# EAGLE schematic vco-arduino-dac (EAGLE 9.6.1)
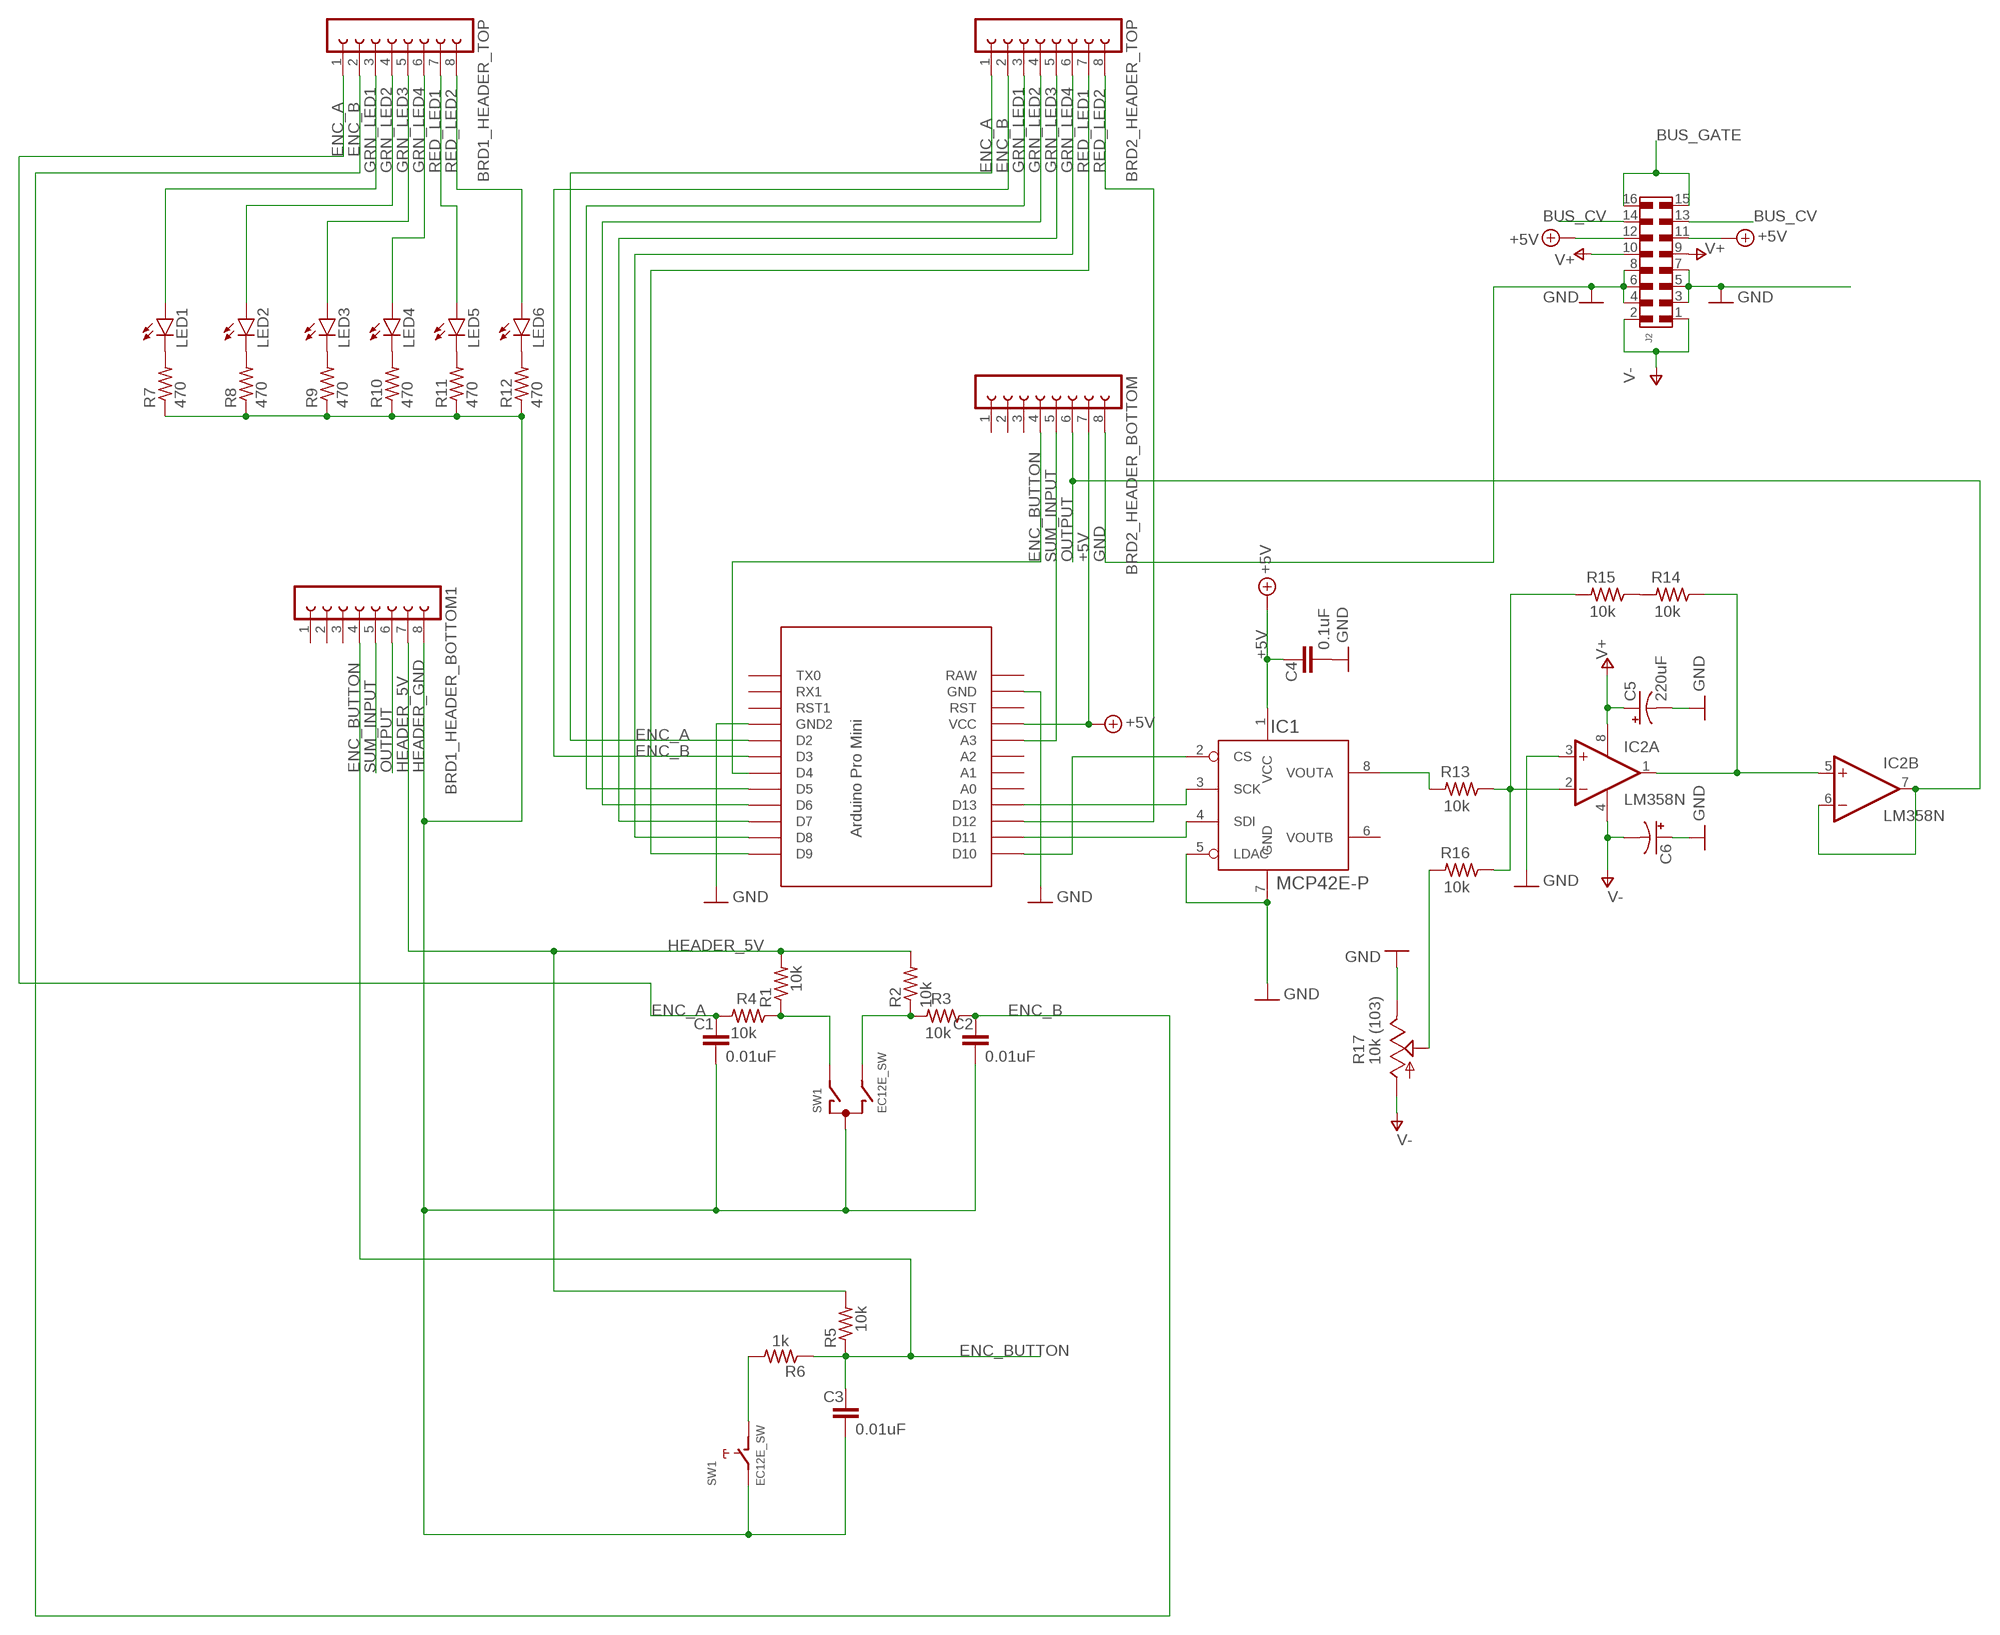
[diagram p0: schematic, sheet 1]

## Parts
BRD1_HEADER_BOTTOM1  FE08-1  [FE08]
BRD1_HEADER_TOP  FE08-1  [FE08]
BRD2_HEADER_BOTTOM  FE08-1  [FE08]
BRD2_HEADER_TOP  FE08-1  [FE08]
C1  0.01uF  C-EU025-024X044  [C025-024X044]
C2  0.01uF  C-EU025-024X044  [C025-024X044]
C3  0.01uF  C-EU025-024X044  [C025-024X044]
C4  0.1uF  C-EU025-024X044  [C025-024X044]
C5  220uF  CPOL-USE2,5-6E  [E2,5-6E]
C6  CPOL-USE2,5-6E  [E2,5-6E]
IC1  MCP42E-P  [DIL08]
IC2  LM358N  [DIL08]
J2  6120XX20621_61201620621  [61201620621]
LED1  LED3MM  [LED3MM]
LED2  LED3MM  [LED3MM]
LED3  LED3MM  [LED3MM]
LED4  LED3MM  [LED3MM]
LED5  LED3MM  [LED3MM]
LED6  LED3MM  [LED3MM]
R1  10k  R-US_0204/7  [0204/7]
R2  10k  R-US_0204/7  [0204/7]
R3  10k  R-US_0204/7  [0204/7]
R4  10k  R-US_0204/7  [0204/7]
R5  10k  R-US_0204/7  [0204/7]
R6  1k  R-US_0204/7  [0204/7]
R7  470  R-US_0204/7  [0204/7]
R8  470  R-US_0204/7  [0204/7]
R9  470  R-US_0204/7  [0204/7]
R10  470  R-US_0204/7  [0204/7]
R11  470  R-US_0204/7  [0204/7]
R12  470  R-US_0204/7  [0204/7]
R13  10k  R-US_0204/7  [0204/7]
R14  10k  R-US_0204/7  [0204/7]
R15  10k  R-US_0204/7  [0204/7]
R16  10k  R-US_0204/7  [0204/7]
R17  10k (103)  TRIM_US-S64W  [S64W]
SW1  EC12E_SW  [ALPS_EC12E_SW]
U$1  PRO-MINI-MINUS-HEADERS  [PRO-MINI-2-NO-HEADERS]

## Nets
+5V: BRD2_HEADER_BOTTOM.7 C4.1 IC1.1(VCC) J2.11 J2.12 U$1.VCC
BUS_CV: J2.13 J2.14
BUS_GATE: J2.15 J2.16
ENC_A: BRD1_HEADER_TOP.1 BRD2_HEADER_TOP.1 C1.1 R4.2 U$1.D2
ENC_B: BRD1_HEADER_TOP.2 BRD2_HEADER_TOP.2 C2.1 R3.1 U$1.D3
ENC_BUTTON: BRD1_HEADER_BOTTOM1.4 BRD2_HEADER_BOTTOM.4 C3.1 R5.1 R6.1 U$1.D4
GND: BRD2_HEADER_BOTTOM.8 C4.2 C5.- C6.+ IC1.5(LDAC) IC1.7(GND) IC2.3(A:+IN) J2.3 J2.4 J2.5 J2.6 J2.7 J2.8 R17.E U$1.GND
GRN_LED1: BRD1_HEADER_TOP.3 BRD2_HEADER_TOP.3 LED1.A U$1.D5
GRN_LED2: BRD1_HEADER_TOP.4 BRD2_HEADER_TOP.4 LED2.A U$1.D6
GRN_LED3: BRD1_HEADER_TOP.5 BRD2_HEADER_TOP.5 LED3.A U$1.D7
GRN_LED4: BRD1_HEADER_TOP.6 BRD2_HEADER_TOP.6 LED4.A U$1.D8
HEADER_5V: BRD1_HEADER_BOTTOM1.7 R1.2 R2.2 R5.2
HEADER_GND: BRD1_HEADER_BOTTOM1.8 C1.2 C2.2 C3.2 R7.1 R8.1 R9.1 R10.1 R11.1 R12.1 SW1.C SW1.E
N$1: R1.1 R4.1 SW1.A
N$2: R2.1 R3.2 SW1.B
N$3: R6.2 SW1.D
N$4: IC1.2(CS) U$1.D10
N$5: IC1.3(SCK) U$1.D13
N$6: IC1.4(SDI) U$1.D11
N$7: LED2.K(C) R8.2
N$8: LED3.K(C) R9.2
N$9: LED4.K(C) R10.2
N$10: LED1.K(C) R7.2
N$11: LED5.K(C) R11.2
N$12: LED6.K(C) R12.2
N$13: U$1.GND1(GND2) ; supply symbol labelled GND
N$14: R14.2 R15.1
N$15: IC2.2(A:-IN) R13.1 R15.2 R16.1
N$16: IC1.8(VOUTA) R13.2
N$17: IC2.1(A:OUT) IC2.5(B:+IN) R14.1
N$18: R16.2 R17.S
OUTPUT: BRD1_HEADER_BOTTOM1.6 BRD2_HEADER_BOTTOM.6 IC2.6(B:-IN) IC2.7(B:OUT)
RED_LED1: BRD1_HEADER_TOP.7 BRD2_HEADER_TOP.7 LED5.A U$1.D9
RED_LED2: BRD1_HEADER_TOP.8 BRD2_HEADER_TOP.8 LED6.A U$1.D12
SUM_INPUT: BRD1_HEADER_BOTTOM1.5 BRD2_HEADER_BOTTOM.5 U$1.A3
V+: C5.+ IC2.8(P:V+) J2.9 J2.10
V-: C6.- IC2.4(P:V-) J2.1 J2.2 R17.A
Unconnected: BRD1_HEADER_BOTTOM1.1 BRD1_HEADER_BOTTOM1.2 BRD1_HEADER_BOTTOM1.3 BRD2_HEADER_BOTTOM.1 BRD2_HEADER_BOTTOM.2 BRD2_HEADER_BOTTOM.3 IC1.6(VOUTB) SW1.GND1(G) SW1.GND2(G) U$1.A0 U$1.A1 U$1.A2 U$1.RAW U$1.RST U$1.RST1 U$1.RX1 U$1.TX0

## Library data of the parts
BRD1_HEADER_BOTTOM1 BRD1_HEADER_TOP BRD2_HEADER_BOTTOM BRD2_HEADER_TOP = con-lsta:FE08-1: FEMALE HEADER; OC_FARNELL: unknown; OC_NEWARK: unknown
C1-C4 = rcl:C-EU: CAPACITOR, European symbol; SPICEPREFIX: C
C5 C6 = rcl:CPOL-US: POLARIZED CAPACITOR, American symbol; SPICEPREFIX: C
IC1 = dac:MCP4*2: DAC 8BIT DUAL SPI/VREF
IC2 = linear:LM358: OP AMP also LM158; LM258; LM2904 Source: http://cache.national.com/ds/LM/LM158.pdf
J2 = Wurth_Connectors_WR-BHD:6120XX20621_61201620621: WR-BHD 2.54 mm Male SMT Box Header KIND PROPERTIES: Pitch 2.54 mm Gender:Male MATERIAL PROPERTIES: Insulator Material:PA6T Insulator Flammability Rating UL94 V-0 Insulator Color:Black Contact Material :Copper Alloy Contact Plating :Gold Contact Type: Stamped GENERAL INFORMATION: Operating Temperature:-40 °C up to +125 °C Compliance:RoHS Working Voltage: 250 V (AC) Withstanding Voltage:500 V (AC) Contact Resistance: 20 mΩ Insulation Resistance:1000 MΩ CERTIFICATION: UL Approval:E323964 PACKAGING PROPERTIES Packaging :Tube <https://katalog.we-online.com/media/images/v2/o32919v209%20Family_WR-BHD_612xxx20621.jpg> Details see: https://katalog.we-online.com/en/em/BHD_2_54_SMT_MALE_BOX_HEADER_6120XX20621 Updated by Yingchun,Shan 2019-10-30 2019 (C) Würth Elektronik; CONTACT-RESISTANCE: 20mOhm; DATASHEET-URL: https://katalog.we-online.com/em/datasheet/61201620621.pdf; GENDER: Male; IR: 3A; L: 28.12mm; MOUNT: SMT; PACKAGING: Tube; PART-NUMBER: 61201620621; PINS: 16; PITCH: 2.54mm; TOL-R: max.; TYPE: Straight; WORKING-VOLTAGE: 250V(AC)
LED1-LED6 = led:LED: LED OSRAM: - CHIPLED LG R971, LG N971, LY N971, LG Q971, LY Q971, LO R971, LY R971 LH N974, LH R974 LS Q976, LO Q976, LY Q976 LO Q996 - Hyper CHIPLED LW Q18S LB Q993, LB Q99A, LB R99A - SideLED LS A670, LO A670, LY A670, LG A670, LP A670 LB A673, LV A673, LT A673, LW A673 LH A674 LY A675 LS A676, LA A676, LO A676, LY A676, LW A676 LS A679, LY A679, LG A679 - Hyper Micro SIDELED® LS Y876, LA Y876, LO Y876, LY Y876 LT Y87S - SmartLED LW L88C, LW L88S LB L89C, LB L89S, LG L890 LS L89K, LO L89K, LY L89K LS L896, LA L896, LO L896, LY L896 - TOPLED LS T670, LO T670, LY T670, LG T670, LP T670 LSG T670, LSP T670, LSY T670, LOP T670, LYG T670 LG T671, LOG T671, LSG T671 LB T673, LV T673, LT T673, LW T673 LH T674 LS T676, LA T676, LO T676, LY T676, LB T676, LH T676, LSB T676, LW T676 LB T67C, LV T67C, LT T67C, LS T67K, LO T67K, LY T67K, LW E67C LS E67B, LA E67B, LO E67B, LY E67B, LB E67C, LV E67C, LT E67C LW T67C LS T679, LY T679, LG T679 LS T770, LO T770, LY T770, LG T770, LP T770 LB T773, LV T773, LT T773, LW T773 LH T774 LS E675, LA E675, LY E675, LS T675 LS T776, LA T776, LO T776, LY T776, LB T776 LHGB T686 LT T68C, LB T68C - Hyper Mini TOPLED® LB M676 - Mini TOPLED Santana® LG M470 LS M47K, LO M47K, LY M47K Source: http://www.osram.convergy.de LUXEON: - LUMILED® LXK2-PW12-R00, LXK2-PW12-S00, LXK2-PW14-U00, LXK2-PW14-V00 LXK2-PM12-R00, LXK2-PM12-S00, LXK2-PM14-U00 LXK2-PE12-Q00, LXK2-PE12-R00, LXK2-PE12-S00, LXK2-PE14-T00, LXK2-PE14-U00 LXK2-PB12-K00, LXK2-PB12-L00, LXK2-PB12-M00, LXK2-PB14-N00, LXK2-PB14-P00, LXK2-PB14-Q00 LXK2-PR12-L00, LXK2-PR12-M00, LXK2-PR14-Q00, LXK2-PR14-R00 LXK2-PD12-Q00, LXK2-PD12-R00, LXK2-PD12-S00 LXK2-PH12-R00, LXK2-PH12-S00 LXK2-PL12-P00, LXK2-PL12-Q00, LXK2-PL12-R00 Source: www.luxeon.com KINGBRIGHT: KA-3528ASYC Source: www.kingbright.com
R1-R16 = rcl:R-US_: RESISTOR, American symbol; SPICEPREFIX: R
R17 = pot:TRIM_US-: POTENTIOMETER
SW1 = switch-alps:EC12E_SW: ALPS rotary Encoder EC12E series with switch; MPN: EC12E2424407; OC_FARNELL: 1520813; OC_NEWARK: 74M1068
U$1 = Arduino-clone-custom:PRO-MINI-MINUS-HEADERS